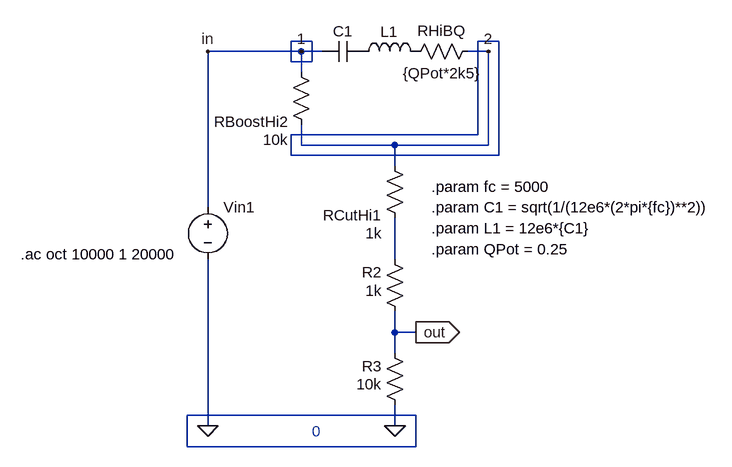
[diagram p0: schematic HiBoost.asc]
HiBoost.asc, the LTspice schematic file:
Version 4
SHEET 1 1172 680
WIRE 80 -240 48 -240
WIRE 368 -240 336 -240
WIRE 64 -224 -80 -224
WIRE 96 -224 64 -224
WIRE 352 -224 320 -224
WIRE 48 -208 48 -240
WIRE 80 -208 80 -240
WIRE 80 -208 48 -208
WIRE 64 -192 64 -224
WIRE 336 -96 336 -240
WIRE 336 -96 48 -96
WIRE 64 -80 64 -112
WIRE 208 -80 64 -80
WIRE 352 -80 352 -224
WIRE 352 -80 208 -80
WIRE 48 -64 48 -96
WIRE 368 -64 368 -240
WIRE 368 -64 48 -64
WIRE 208 -48 208 -80
WIRE -80 16 -80 -224
WIRE 208 96 208 32
WIRE 208 208 208 176
WIRE 240 208 208 208
WIRE 208 240 208 208
WIRE 240 336 -112 336
WIRE -80 352 -80 96
WIRE 208 352 208 320
WIRE -112 384 -112 336
WIRE 240 384 240 336
WIRE 240 384 -112 384
FLAG -80 352 0
FLAG 208 352 0
FLAG 240 208 out
IOPIN 240 208 Out
FLAG -80 -224 in
FLAG 64 -224 1
FLAG 352 -224 2
SYMBOL cap 96 -208 R270
WINDOW 0 47 17 VRight 2
WINDOW 3 0 32 Invisible 2
SYMATTR InstName C1
SYMATTR Value {C1}
SYMBOL ind 144 -208 R270
WINDOW 0 46 42 VRight 2
WINDOW 3 1 57 Invisible 2
SYMATTR InstName L1
SYMATTR Value {L1}
SYMBOL voltage -80 0 R0
WINDOW 3 24 96 Invisible 2
SYMATTR Value ""
SYMATTR Value2 AC 1
SYMATTR InstName Vin1
SYMBOL res 80 -96 R180
WINDOW 0 36 20 Left 2
WINDOW 3 36 -8 Left 2
SYMATTR InstName RBoostHi2
SYMATTR Value 10k
SYMBOL res 336 -240 R90
WINDOW 0 0 56 VBottom 2
WINDOW 3 65 56 VBottom 2
SYMATTR InstName RHiBQ
SYMATTR Value {QPot*2k5}
SYMBOL res 224 48 R180
WINDOW 0 36 20 Left 2
WINDOW 3 36 -8 Left 2
SYMATTR InstName RCutHi1
SYMATTR Value 1k
SYMBOL res 224 192 R180
WINDOW 0 36 76 Left 2
WINDOW 3 36 48 Left 2
SYMATTR InstName R2
SYMATTR Value 1k
SYMBOL res 224 336 R180
WINDOW 0 36 76 Left 2
WINDOW 3 36 48 Left 2
SYMATTR InstName R3
SYMATTR Value 10k
TEXT 80 360 Left 2 ;0
TEXT -368 88 Left 2 !.ac oct 10000 1 20000
TEXT 264 80 Left 2 !.param QPot = 0.25
TEXT 264 -16 Left 2 !.param fc = 5000
TEXT 264 16 Left 2 !.param C1 = sqrt(1/(12e6*(2*pi*{fc})**2))
TEXT 264 48 Left 2 !.param L1 = 12e6*{C1}

The netlist it stands for:
* HiBoost.asc
C1 1 P001 {C1}
L1 P001 P002 {L1}
Vin1 1 0 AC 1
RBoostHi2 2 1 10k
RHiBQ 2 P002 {QPot*2k5}
RCutHi1 N003 2 1k
R2 out N003 1k
R3 0 out 10k
* 0
.ac oct 10000 1 20000
.param QPot = 0.25
.param fc = 5000
.param C1 = sqrt(1/(12e6*(2*pi*{fc})**2))
.param L1 = 12e6*{C1}
.backanno
.end